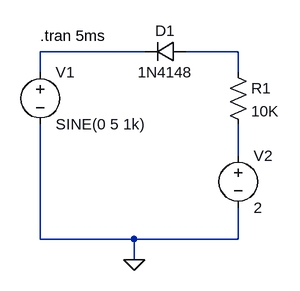
[diagram p0: schematic Clipper.asc]
Clipper.asc, the LTspice schematic file:
Version 4
SHEET 1 880 680
WIRE 112 80 -48 80
WIRE 256 80 176 80
WIRE -48 112 -48 80
WIRE 256 112 256 80
WIRE 256 240 256 192
WIRE -48 368 -48 192
WIRE 96 368 -48 368
WIRE 256 368 256 320
WIRE 256 368 96 368
WIRE 96 400 96 368
FLAG 96 400 0
SYMBOL diode 176 64 R90
WINDOW 0 0 32 VBottom 2
WINDOW 3 32 32 VTop 2
SYMATTR InstName D1
SYMATTR Value 1N4148
SYMBOL res 240 96 R0
SYMATTR InstName R1
SYMATTR Value 10K
SYMBOL voltage -48 96 R0
WINDOW 123 0 0 Left 0
WINDOW 39 0 0 Left 0
SYMATTR InstName V1
SYMATTR Value SINE(0 5 1k)
SYMBOL voltage 256 224 R0
WINDOW 123 0 0 Left 0
WINDOW 39 0 0 Left 0
SYMATTR InstName V2
SYMATTR Value 2
TEXT -48 56 Left 2 !.tran 5ms

The netlist it stands for:
* Clipper.asc
D1 N002 N001 1N4148
R1 N002 N003 10K
V1 N001 0 SINE(0 5 1k)
V2 N003 0 2
.model D D
.lib standard.dio
.tran 5ms
.backanno
.end